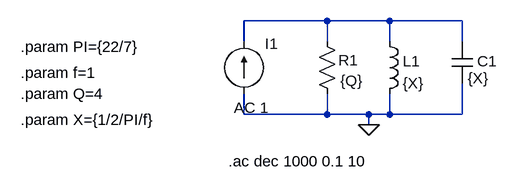
[diagram p0: schematic RLC paralelo.asc]
RLC paralelo.asc, the LTspice schematic file:
Version 4
SHEET 1 880 680
WIRE 144 112 16 112
WIRE 240 112 144 112
WIRE 352 112 240 112
WIRE 16 144 16 112
WIRE 144 144 144 112
WIRE 240 144 240 112
WIRE 352 144 352 112
WIRE 16 256 16 224
WIRE 144 256 144 224
WIRE 144 256 16 256
WIRE 208 256 144 256
WIRE 240 256 240 224
WIRE 240 256 208 256
WIRE 352 256 352 208
WIRE 352 256 240 256
WIRE 208 272 208 256
FLAG 208 272 0
SYMBOL res 128 128 R0
WINDOW 0 33 45 Left 2
SYMATTR InstName R1
SYMATTR Value {Q}
SYMBOL ind 224 128 R0
WINDOW 0 36 46 Left 2
SYMATTR InstName L1
SYMATTR Value {X}
SYMBOL cap 336 144 R0
WINDOW 0 39 30 Left 2
SYMATTR InstName C1
SYMATTR Value {X}
SYMBOL current 16 224 R180
WINDOW 0 -52 77 Left 2
WINDOW 3 -38 6 Left 2
WINDOW 123 -38 -22 Left 2
WINDOW 39 0 0 Left 0
SYMATTR InstName I1
SYMATTR Value ""
SYMATTR Value2 AC 1
TEXT -8 328 Left 2 !.ac dec 1000 0.1 10
TEXT -328 152 Left 2 !.param PI={22/7}
TEXT -328 192 Left 2 !.param f=1
TEXT -328 224 Left 2 !.param Q=4
TEXT -328 264 Left 2 !.param X={1/2/PI/f}

The netlist it stands for:
* RLC paralelo.asc
R1 N001 0 {Q}
L1 N001 0 {X}
C1 N001 0 {X}
I1 0 N001 AC 1
.ac dec 1000 0.1 10
.param PI={22/7}
.param f=1
.param Q=4
.param X={1/2/PI/f}
.backanno
.end